# Altium schematic sheet AD_starter_alternator.SchDoc
size Letter; DocumentNumber: D_12; SheetNumber: 12; SheetTotal: 21
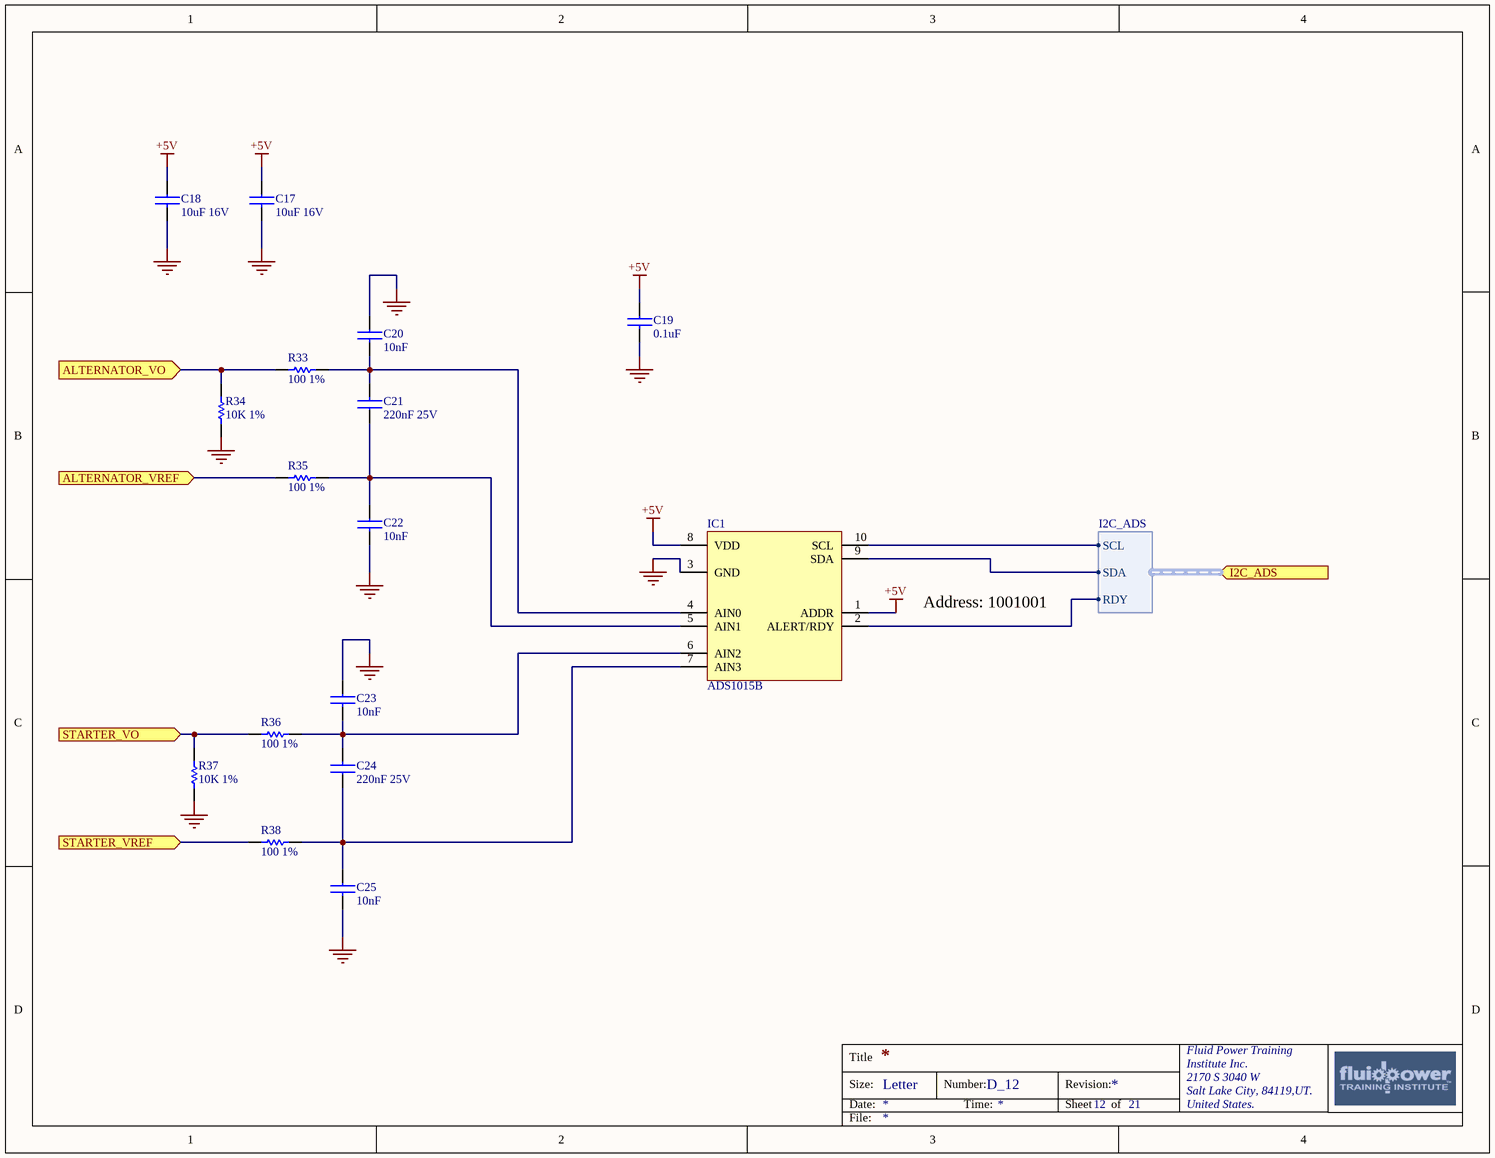
[diagram p0: AD_starter_alternator.SchDoc]

## Parts
C17  10uF 16V  [C0805]
C18  10uF 16V  [C0805]
C19  0.1uF  [C0805]
C20  10nF  [C0805]
C21  220nF 25V  [C0805]
C22  10nF  [C0805]
C23  10nF  [C0805]
C24  220nF 25V  [C0805]
C25  10nF  [C0805]
IC1  ADS1015B  [SOP50P490X110-10N]
R33  100 1%  [R0805]
R34  10K 1%  [R0805]
R35  100 1%  [R0805]
R36  100 1%  [R0805]
R37  10K 1%  [R0805]
R38  100 1%  [R0805]

## Ports
ALTERNATOR_VO (in), ALTERNATOR_VREF (in), I2C_ADS (in, harness I2C_ADS), STARTER_VO (in), STARTER_VREF (in)

## Harnesses
I2C_ADS: SCL, SDA, RDY

## Nets
+5V: C17.1 C18.1 C19.1 IC1.1(ADDR) IC1.8(VDD)
GND: C17.2 C18.2 C19.2 C20.1 C22.2 C23.1 C25.2 IC1.3(GND) R34.1 R37.1
ALTERNATOR_VO: R33.1 R34.2 ; port ALTERNATOR_VO
ALTERNATOR_VREF: R35.1 ; port ALTERNATOR_VREF
STARTER_VO: R36.1 R37.2 ; port STARTER_VO
STARTER_VREF: R38.1 ; port STARTER_VREF
NetC20_2: C20.2 C21.2 IC1.4(AIN0) R33.2
NetC21_1: C21.1 C22.1 IC1.5(AIN1) R35.2
NetC23_2: C23.2 C24.2 IC1.6(AIN2) R36.2
NetC24_1: C24.1 C25.1 IC1.7(AIN3) R38.2
NetIC1_2: IC1.2(ALERT/RDY) ; port I2C_ADS.RDY
NetIC1_9: IC1.9(SDA) ; port I2C_ADS.SDA
NetIC1_10: IC1.10(SCL) ; port I2C_ADS.SCL

## Notes on the sheet
- Address: 1001001
- Title
- Size:
- Date:
- Letter
- Number:
- Time:
- Revision:
- Sheet
- of
- Fluid Power Training
- Institute Inc.
- 2170 S 3040 W
- Salt Lake City, 84119,UT.
- United States.
- File:

## Library data of the parts
C17 C18 = GRM21BR61C106KE15L: CAP CER 10UF 16V X5R 0805; Manufacturer: Murata; Material: Ceramic; Tolerance: 10%; Supplier 1: Mouser; Supplier Part Number 1: 81-GRM21BR61C106KE15; Manufacturer Part Number: GRM21BR61C106KE15L; RoHS: Yes; Category: Ceramic Capacitors; Stock 1: 796080; Pricing 1: 1=0.31000, 10=0.21500, 100=0.12000, 500=0.08600, 1000=0.07500, 3000=0.06200 (USD); Mount: Surface Mount; Case/Package: 0805; Case Code (Imperial): 0805; Case Code (Metric): 2012; Min Operating Temperature: -55°C; Max Operating Temperature: 85°C; Packaging: Tape and Reel; Capacitance: 10uF; Voltage Rating: 16V; Package Quantity: 1; Voltage Rating (DC): 16V; Termination: SMD/SMT; Voltage: 16V; Dielectric: X5R; Length: 2mm; Height: 1.25mm; Width: 1.25mm; Depth: 1.25mm; Thickness: 0.053inch; Radiation Hardening: No; REACH SVHC: No SVHC; Lead Free: Lead Free; ComponentLink1URL: https://datasheet.ciiva.com/2989/product-2989696.pdf?src-supplier=Avnet; ComponentLink1Description: https://datasheet.ciiva.com/2989/product-2989696.pdf?src-supplier=Avnet; ComponentLink2URL: https://datasheet.ciiva.com/3777/1956grm21br61c106ke1523-3777137.pdf?src-supplier=Arrow; ComponentLink2Description: https://datasheet.ciiva.com/3777/1956grm21br61c106ke1523-3777137.pdf?src-supplier=Arrow; ComponentLink3URL: https://datasheet.ciiva.com/7719/1747468-7719090.pdf?src-supplier=Element14; ComponentLink3Description: https://datasheet.ciiva.com/7719/1747468-7719090.pdf?src-supplier=Element14; ComponentLink4URL: https://datasheet.ciiva.com/23628/460993-23628598.pdf?src-supplier=Newark; ComponentLink4Description: https://datasheet.ciiva.com/23628/460993-23628598.pdf?src-supplier=Newark; ComponentLink5URL: https://datasheet.ciiva.com/29202/450891-da-01-de-vs-chip-kond-0805-10-0-uf-10pr-16-0v-x5r-29202696.pdf?src-supplier=Conrad; ComponentLink5Description: https://datasheet.ciiva.com/29202/450891-da-01-de-vs-chip-kond-0805-10-0-uf-10pr-16-0v-x5r-29202696.pdf?src-supplier=Conrad; ComponentLink6URL: https://datasheet.ciiva.com/29199/454607-da-01-en-vs-kondensator-0805-29199611.pdf?src-supplier=Conrad; ComponentLink6Description: https://datasheet.ciiva.com/29199/454607-da-01-en-vs-kondensator-0805-29199611.pdf?src-supplier=Conrad; ComponentLink7URL: https://datasheet.ciiva.com/2989/product-2989697.pdf?src-supplier=Avnet; ComponentLink7Description: https://datasheet.ciiva.com/2989/product-2989697.pdf?src-supplier=Avnet; ComponentLink8URL: https://datasheet.ciiva.com/137/partnumbering-e-01-137917.pdf?src-supplier=Digi-Key; ComponentLink8Description: https://datasheet.ciiva.com/137/partnumbering-e-01-137917.pdf?src-supplier=Digi-Key; ComponentLink9URL: https://datasheet.ciiva.com/137/partnumbering-e-01-137918.pdf?src-supplier=Digi-Key; ComponentLink9Description: https://datasheet.ciiva.com/137/partnumbering-e-01-137918.pdf?src-supplier=Digi-Key; ComponentLink10URL: https://datasheet.ciiva.com/137/partnumbering-e-01-137919.pdf?src-supplier=Digi-Key; ComponentLink10Description: https://datasheet.ciiva.com/137/partnumbering-e-01-137919.pdf?src-supplier=Digi-Key
C19 = C0805C104K5RACTU: Cap Ceramic 0.1uF 50V X7R 10% SMD 2.0 x 1.2 mm 125 C Paper T/R; Manufacturer: KEMET; Capacitance: 100nF; Voltage: 500V; Supplier 1: Mouser; Supplier Part Number 1: 80-C0805C104K5R; Manufacturer Part Number: C0805C104K5RACTU; RoHS: Yes; Category: Ceramic Capacitors; Stock 1: 4177670; Pricing 1: 1=0.17000, 10=0.10400, 100=0.05600, 500=0.03900, 1000=0.03200, 4000=0.02400 (USD); Mount: Surface Mount,PCB; Case/Package: 0805; Number of Pins: 2; Case Code (Imperial): 0805; Case Code (Metric): 2012; Dielectric Material: Ceramic; Contact Plating: Tin,Matte; Min Operating Temperature: -55°C; Max Operating Temperature: 125°C; Voltage Rating: 50V; Tolerance: 10%; Packaging: Tape and Reel; Dielectric: X7R; Package Quantity: 4000; Voltage Rating (DC): 50V; Termination: SMD/SMT; Length: 2mm; Height: 0.9mm; Width: 1.2mm; Depth: 1.25mm; Thickness: 0.035inch; Lead Pitch: 0.75mm; Radiation Hardening: No; REACH SVHC: No SVHC; ComponentLink1URL: https://datasheet.ciiva.com/14589/70095383-14589048.pdf?src-supplier=Allied+Electronics; ComponentLink1Description: https://datasheet.ciiva.com/14589/70095383-14589048.pdf?src-supplier=Allied+Electronics; ComponentLink2URL: https://datasheet.ciiva.com/28682/1851736-28682232.pdf?src-supplier=Element14; ComponentLink2Description: https://datasheet.ciiva.com/28682/1851736-28682232.pdf?src-supplier=Element14; ComponentLink3URL: https://datasheet.ciiva.com/32431/slceramic-chip-condensers-e-32431755.pdf?src-supplier=Distrelec; ComponentLink3Description: https://datasheet.ciiva.com/32431/slceramic-chip-condensers-e-32431755.pdf?src-supplier=Distrelec; ComponentLink4URL: https://datasheet.ciiva.com/18410/70095383-18410815.pdf?src-supplier=Allied+Electronics; ComponentLink4Description: https://datasheet.ciiva.com/18410/70095383-18410815.pdf?src-supplier=Allied+Electronics
C20 C22 C23 C25 = CC0805KRX7R9BB103: YAGEO - CC0805KRX7R9BB103 - SMD Multilayer Ceramic Capacitor, 10000 pF, 50 V, 0805 [2012 Metric], ± 10%, X7R, CC Series; Voltage Rating: 50V; Insulation Resistance: 100GR; Supplier 1: Mouser; Supplier Part Number 1: 603-CC805KRX7R9BB103; Manufacturer: Yageo; Manufacturer Part Number: CC0805KRX7R9BB103; RoHS: Yes; Category: Ceramic Capacitors; Stock 1: 473100; Pricing 1: 1=0.11000, 10=0.05700, 100=0.02600, 1000=0.02100, 4000=0.01600, 8000=0.01400 (USD); Mount: Surface Mount; Case/Package: 0805; Number of Pins: 2; Case Code (Imperial): 0805; Case Code (Metric): 2012; Material: Ceramic; Min Operating Temperature: -55°C; Max Operating Temperature: 125°C; Packaging: Tape and Reel; Capacitance: 10nF; Tolerance: 10%; Package Quantity: 1; Dielectric: X7R; Termination: SMD/SMT; Voltage Rating (DC): 50V; Voltage: 50V; Composition: Ceramic; Length: 2mm; Height: 0.6mm; Width: 1.25mm; Depth: 1.25mm; Thickness: 0.024inch; Radiation Hardening: No; REACH SVHC: No SVHC; Lead Free: Lead Free; Halogen Free: Halogen Free; ComponentLink1URL: https://datasheet.ciiva.com/11786/0900766b80d84f1d-11786119.pdf?src-supplier=RSComponents; ComponentLink1Description: https://datasheet.ciiva.com/11786/0900766b80d84f1d-11786119.pdf?src-supplier=RSComponents; ComponentLink2URL: https://datasheet.ciiva.com/25613/0900766b8027bcf6-25613113.pdf?src-supplier=RSComponents; ComponentLink2Description: https://datasheet.ciiva.com/25613/0900766b8027bcf6-25613113.pdf?src-supplier=RSComponents; ComponentLink3URL: https://datasheet.ciiva.com/144/mlccorderingcode-144533.pdf?src-supplier=Digi-Key; ComponentLink3Description: https://datasheet.ciiva.com/144/mlccorderingcode-144533.pdf?src-supplier=Digi-Key; ComponentLink4URL: https://datasheet.ciiva.com/144/mlccorderingcode-144534.pdf?src-supplier=Digi-Key; ComponentLink4Description: https://datasheet.ciiva.com/144/mlccorderingcode-144534.pdf?src-supplier=Digi-Key; ComponentLink5URL: https://datasheet.ciiva.com/46372/1784427-46372638.pdf?src-supplier=Element14; ComponentLink5Description: https://datasheet.ciiva.com/46372/1784427-46372638.pdf?src-supplier=Element14; ComponentLink6URL: https://datasheet.ciiva.com/144/mlccorderingcode-144532.pdf?src-supplier=Digi-Key; ComponentLink6Description: https://datasheet.ciiva.com/144/mlccorderingcode-144532.pdf?src-supplier=Digi-Key; ComponentLink7URL: https://datasheet.ciiva.com/16625/upy-gphc-x7r-6-3v-to-50v-8-16625548.pdf?src-supplier=Avnet+Europe; ComponentLink7Description: https://datasheet.ciiva.com/16625/upy-gphc-x7r-6-3v-to-50v-8-16625548.pdf?src-supplier=Avnet+Europe; ComponentLink8URL: https://datasheet.ciiva.com/22749/1489800-22749215.pdf?src-supplier=Element14; ComponentLink8Description: https://datasheet.ciiva.com/22749/1489800-22749215.pdf?src-supplier=Element14; ComponentLink9URL: https://datasheet.ciiva.com/46372/1734573-46372639.pdf?src-supplier=Element14; ComponentLink9Description: https://datasheet.ciiva.com/46372/1734573-46372639.pdf?src-supplier=Element14
C21 C24 = 08053C224JAT2A: AVX - 08053C224JAT2A - SMD Multilayer Ceramic Capacitor, 0.22 UF, 5%, X7R, 25 V, 0805 [2012 Metric] RoHS Compliant: Yes; Manufacturer: Kyocera AVX; Supplier 1: Mouser; Supplier Part Number 1: 581-08053C224JAT2A; Manufacturer Part Number: 08053C224JAT2A; RoHS: Yes; Category: Ceramic Capacitors; Stock 1: 712; Pricing 1: 1=0.28000, 10=0.19000, 100=0.09600, 500=0.09400, 1000=0.09400, 2000=0.09400 (USD); Mount: Surface Mount,PCB; Case/Package: 0805; Number of Pins: 2; Case Code (Imperial): 0805; Case Code (Metric): 2012; Dielectric Material: Ceramic; Contact Plating: Tin,Matte; Min Operating Temperature: -55°C; Max Operating Temperature: 125°C; Capacitance: 220nF; Tolerance: 5%; Packaging: Tape and Reel; Dielectric: X7R; Voltage Rating: 25V; Voltage Rating (DC): 25V; Termination: SMD/SMT; Package Quantity: 1; Voltage: 25V; Length: 2.01mm; Height: 1.4mm; Width: 1.25mm; Depth: 1.25mm; Thickness: 0.055inch; Radiation Hardening: No; REACH SVHC: No SVHC; Lead Free: Lead Free; ComponentLink1URL: https://datasheet.ciiva.com/5417/cx7r-218113-5417493.pdf?src-supplier=Mouser; ComponentLink1Description: https://datasheet.ciiva.com/5417/cx7r-218113-5417493.pdf?src-supplier=Mouser; ComponentLink2URL: https://datasheet.ciiva.com/16326/cx7r-16326599.pdf?src-supplier=Future+Electronics; ComponentLink2Description: https://datasheet.ciiva.com/16326/cx7r-16326599.pdf?src-supplier=Future+Electronics; ComponentLink3URL: https://datasheet.ciiva.com/162/cx7r-162344.pdf?src-supplier=Digi-Key; ComponentLink3Description: https://datasheet.ciiva.com/162/cx7r-162344.pdf?src-supplier=Digi-Key; ComponentLink4URL: https://datasheet.ciiva.com/162/cx7r-162345.pdf?src-supplier=Digi-Key; ComponentLink4Description: https://datasheet.ciiva.com/162/cx7r-162345.pdf?src-supplier=Digi-Key; ComponentLink5URL: https://datasheet.ciiva.com/162/cx7r-162346.pdf?src-supplier=Digi-Key; ComponentLink5Description: https://datasheet.ciiva.com/162/cx7r-162346.pdf?src-supplier=Digi-Key; ComponentLink6URL: https://datasheet.ciiva.com/17494/cx7r-17494874.pdf?src-supplier=Avnet+Europe; ComponentLink6Description: https://datasheet.ciiva.com/17494/cx7r-17494874.pdf?src-supplier=Avnet+Europe; ComponentLink7URL: https://datasheet.ciiva.com/14594/70001075-14594669.pdf?src-supplier=Allied+Electronics; ComponentLink7Description: https://datasheet.ciiva.com/14594/70001075-14594669.pdf?src-supplier=Allied+Electronics; ComponentLink8URL: https://datasheet.ciiva.com/7811/cx7r-7811999.pdf?src-supplier=Element14; ComponentLink8Description: https://datasheet.ciiva.com/7811/cx7r-7811999.pdf?src-supplier=Element14
IC1 = ADS1015BQDGSRQ1: ADS1015B Automotive 12-Bit ADC; Manufacturer: Texas Instruments; Interface: I2C; Number of Inputs: 4; Supplier 1: Mouser; Manufacturer Part Number: ADS1015BQDGSRQ1; RoHS: No; Category: Analog to Digital Converters (ADCs); Stock 1: 3359; Pricing 1: 1=3.25000, 10=2.92000, 100=2.27000, 250=2.27000, 500=1.96000, 1000=1.63000, 2500=1.52000, 5000=1.48000 (USD); Min Operating Temperature: -40°C; Max Operating Temperature: 125°C; ComponentLink1URL: http://www.ti.com/lit/ds/symlink/ads1013-q1.pdf?src-supplier=Digi-Key; ComponentLink1Description: http://www.ti.com/lit/ds/symlink/ads1013-q1.pdf?src-supplier=Digi-Key; ComponentLink2URL: http://www.ti.com/general/docs/lit/getliterature.tsp?genericPartNumber=ADS1015-Q1&fileType=pdf&src-supplier=Farnell; ComponentLink2Description: http://www.ti.com/general/docs/lit/getliterature.tsp?genericPartNumber=ADS1015-Q1&fileType=pdf&src-supplier=Farnell; Supplier Part Number 1: 595-ADS1015BQDGSRQ1
R33 R35 R36 R38 = CRCW0805100RFKEA: Res Thick Film 0805 100 Ohm 1% 0.125W(1/8W) ±100ppm/C Molded SMD Automotive Paper T/R; Manufacturer: Vishay Dale; Resistance: 100R; Temperature Coefficient: 100ppm/°C; Power Rating: 125mW; Voltage Rating: 150V; Supplier 1: Mouser; Supplier Part Number 1: 71-CRCW0805-100-E3; Manufacturer Part Number: CRCW0805100RFKEA; RoHS: Yes; Category: Chip SMD Resistors; Stock 1: 296115; Pricing 1: 1=0.10000, 10=0.06200, 100=0.02500, 1000=0.01000, 5000=0.00700, 10000=0.00600 (USD); Mount: Surface Mount; Case/Package: 0805; Number of Pins: 2; Weight: 0.000194oz; Case Code (Metric): 2012; Case Code (Imperial): 0805; Contact Plating: Tin; Min Operating Temperature: -55°C; Max Operating Temperature: 155°C; Tolerance: 1%; Packaging: Tape and Reel; Composition: Thick Film; Termination: SMD/SMT; Voltage Rating (DC): 150V; Number of Terminations: 2; Package Quantity: 10; Max Power Dissipation: 125mW; Features: Automotive AEC-Q200; Military Standard: Not; Length: 2mm; Height: 0.45mm; Width: 0.049inch; Depth: 1.25mm; Radiation Hardening: No; Lead Free: Lead Free; REACH SVHC: Unknown; ComponentLink1URL: https://datasheet.ciiva.com/11809/0900766b80d98b26-11809126.pdf?src-supplier=RSComponents; ComponentLink1Description: https://datasheet.ciiva.com/11809/0900766b80d98b26-11809126.pdf?src-supplier=RSComponents; ComponentLink2URL: https://datasheet.ciiva.com/2495/dcrcwe3-2495842.pdf?src-supplier=Digi-Key; ComponentLink2Description: https://datasheet.ciiva.com/2495/dcrcwe3-2495842.pdf?src-supplier=Digi-Key; ComponentLink3URL: https://datasheet.ciiva.com/2495/dcrcwe3-2495844.pdf?src-supplier=Digi-Key; ComponentLink3Description: https://datasheet.ciiva.com/2495/dcrcwe3-2495844.pdf?src-supplier=Digi-Key; ComponentLink4URL: https://datasheet.ciiva.com/16514/dcrcwe3-16514904.pdf?src-supplier=Avnet+Asia; ComponentLink4Description: https://datasheet.ciiva.com/16514/dcrcwe3-16514904.pdf?src-supplier=Avnet+Asia; ComponentLink5URL: https://datasheet.ciiva.com/8337/dcrcwe3-8337753.pdf?src-supplier=Avnet; ComponentLink5Description: https://datasheet.ciiva.com/8337/dcrcwe3-8337753.pdf?src-supplier=Avnet; ComponentLink6URL: https://datasheet.ciiva.com/16777/70201119-16777129.pdf?src-supplier=Allied+Electronics; ComponentLink6Description: https://datasheet.ciiva.com/16777/70201119-16777129.pdf?src-supplier=Allied+Electronics; ComponentLink7URL: https://datasheet.ciiva.com/3258/dcrcwe3-3258011.pdf?src-supplier=Avnet; ComponentLink7Description: https://datasheet.ciiva.com/3258/dcrcwe3-3258011.pdf?src-supplier=Avnet; ComponentLink8URL: https://datasheet.ciiva.com/16760/70201119-16760940.pdf?src-supplier=Allied+Electronics; ComponentLink8Description: https://datasheet.ciiva.com/16760/70201119-16760940.pdf?src-supplier=Allied+Electronics; ComponentLink9URL: https://datasheet.ciiva.com/2495/dcrcwe3-2495843.pdf?src-supplier=Digi-Key; ComponentLink9Description: https://datasheet.ciiva.com/2495/dcrcwe3-2495843.pdf?src-supplier=Digi-Key; ComponentLink10URL: https://datasheet.ciiva.com/15159/getdatasheetpartid-90825-15159895.pdf?src-supplier=Verical; ComponentLink10Description: https://datasheet.ciiva.com/15159/getdatasheetpartid-90825-15159895.pdf?src-supplier=Verical; ComponentLink11URL: https://datasheet.ciiva.com/5546/dcrcwe3-109170-5546700.pdf?src-supplier=Mouser; ComponentLink11Description: https://datasheet.ciiva.com/5546/dcrcwe3-109170-5546700.pdf?src-supplier=Mouser
R34 R37 = CRCW080510K0FKEA: VISHAY - CRCW080510K0FKEA - SMD Chip Resistor, 0805 [2012 Metric], 10 kohm, CRCW e3 Series, 150 V, Thick Film, 125 mW; Resistance: 10kR; Temperature Coefficient: 100ppm/°C; Power Rating: 125mW; Voltage Rating: 150V; Supplier 1: Mouser; Supplier Part Number 1: 71-CRCW0805-10K-E3; Manufacturer: Vishay; Manufacturer Part Number: CRCW080510K0FKEA; RoHS: Yes; Category: Chip SMD Resistors; Stock 1: 1138857; Pricing 1: 1=0.10000, 10=0.06200, 100=0.02500, 1000=0.01000, 5000=0.00700, 10000=0.00600 (USD); Case/Package: 0805; Weight: 0.000194oz; Case Code (Imperial): 0805; Case Code (Metric): 2012; Contact Plating: Tin; Min Operating Temperature: -55°C; Max Operating Temperature: 155°C; Tolerance: 1%; Packaging: Tape and Reel; Composition: Thick Film; Termination: SMD/SMT; Voltage Rating (DC): 150V; Package Quantity: 5000; Military Standard: Not; Length: 2mm; Height: 0.45mm; Width: 1.25mm; Depth: 1.25mm; Radiation Hardening: No; Lead Free: Lead Free; REACH SVHC: Unknown; ComponentLink1URL: https://datasheet.ciiva.com/11808/0900766b80d98b26-11808216.pdf?src-supplier=RSComponents; ComponentLink1Description: https://datasheet.ciiva.com/11808/0900766b80d98b26-11808216.pdf?src-supplier=RSComponents; ComponentLink2URL: https://datasheet.ciiva.com/5547/dcrcwe3-109170-5547559.pdf?src-supplier=Mouser; ComponentLink2Description: https://datasheet.ciiva.com/5547/dcrcwe3-109170-5547559.pdf?src-supplier=Mouser; ComponentLink3URL: https://datasheet.ciiva.com/16719/70201119-16719082.pdf?src-supplier=Allied+Electronics; ComponentLink3Description: https://datasheet.ciiva.com/16719/70201119-16719082.pdf?src-supplier=Allied+Electronics; ComponentLink4URL: https://datasheet.ciiva.com/16883/dcrcwe3-16883708.pdf?src-supplier=Avnet+Europe; ComponentLink4Description: https://datasheet.ciiva.com/16883/dcrcwe3-16883708.pdf?src-supplier=Avnet+Europe; ComponentLink5URL: https://datasheet.ciiva.com/8337/dcrcwe3-8337773.pdf?src-supplier=Avnet; ComponentLink5Description: https://datasheet.ciiva.com/8337/dcrcwe3-8337773.pdf?src-supplier=Avnet; ComponentLink6URL: https://datasheet.ciiva.com/46394/1720486-46394381.pdf?src-supplier=Element14; ComponentLink6Description: https://datasheet.ciiva.com/46394/1720486-46394381.pdf?src-supplier=Element14; ComponentLink7URL: https://datasheet.ciiva.com/16199/dcrcwe3-16199086.pdf?src-supplier=Future+Electronics; ComponentLink7Description: https://datasheet.ciiva.com/16199/dcrcwe3-16199086.pdf?src-supplier=Future+Electronics; ComponentLink8URL: https://datasheet.ciiva.com/16514/dcrcwe3-16514907.pdf?src-supplier=Avnet+Asia; ComponentLink8Description: https://datasheet.ciiva.com/16514/dcrcwe3-16514907.pdf?src-supplier=Avnet+Asia; ComponentLink9URL: https://datasheet.ciiva.com/16755/70201119-16755389.pdf?src-supplier=Allied+Electronics; ComponentLink9Description: https://datasheet.ciiva.com/16755/70201119-16755389.pdf?src-supplier=Allied+Electronics; ComponentLink10URL: https://datasheet.ciiva.com/8337/dcrcwe3-8337774.pdf?src-supplier=Avnet; ComponentLink10Description: https://datasheet.ciiva.com/8337/dcrcwe3-8337774.pdf?src-supplier=Avnet